# Altium schematic sheet Peripherals.SchDoc
size A4
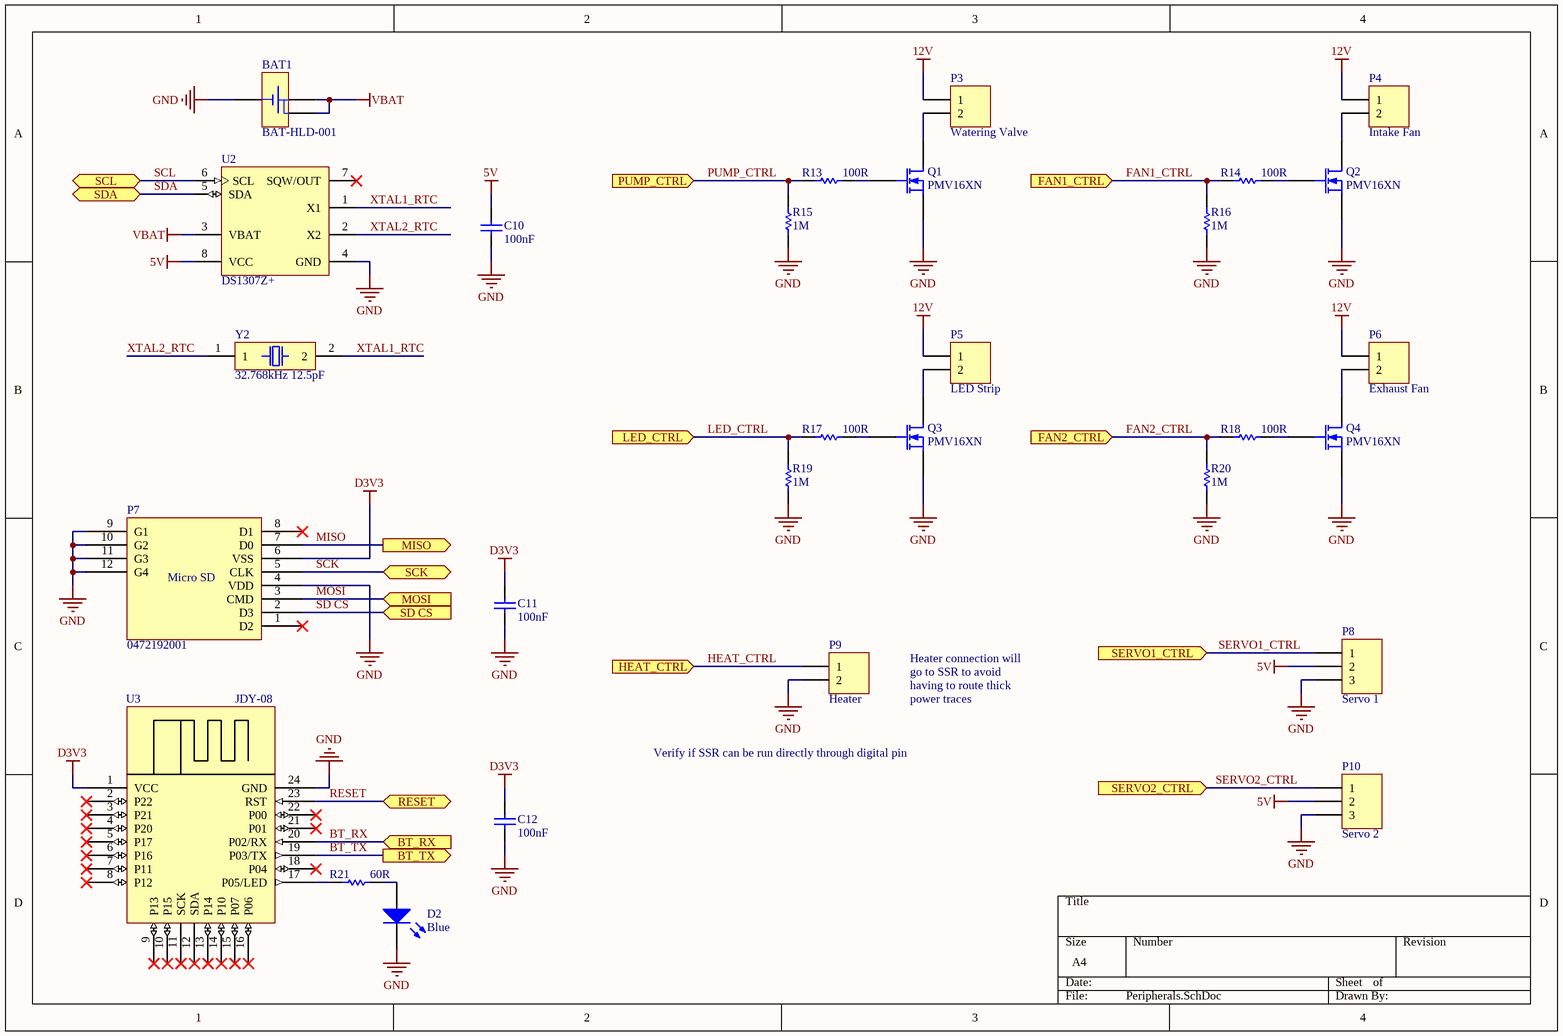
[diagram p0: Peripherals.SchDoc]

## Parts
BAT1  BAT-HLD-001  [BATHLD-001]
C10  100nF  [CAP0603]
C11  100nF  [CAP0603]
C12  100nF  [CAP0603]
D2  Blue  [DIODE0603]
P3  Watering Valve  [MOLEX MICROLATCH 2CT]
P4  Intake Fan  [MOLEX MICROLATCH 2CT]
P5  LED Strip  [MOLEX MICROLATCH 2CT]
P6  Exhaust Fan  [MOLEX MICROLATCH 2CT]
P7  0472192001  [MOLEX MICRO SD]
P8  Servo 1  [MOLEX MICROLATCH 3CT]
P9  Heater  [MOLEX MICROLATCH 2CT]
P10  Servo 2  [MOLEX MICROLATCH 3CT]
Q1  PMV16XN  [SOT-23]
Q2  PMV16XN  [SOT-23]
Q3  PMV16XN  [SOT-23]
Q4  PMV16XN  [SOT-23]
R13  100R  [RES0603]
R14  100R  [RES0603]
R15  1M  [RES0603]
R16  1M  [RES0603]
R17  100R  [RES0603]
R18  100R  [RES0603]
R19  1M  [RES0603]
R20  1M  [RES0603]
R21  60R  [RES0603]
U2  DS1307Z+  [SOIC8 150mil]
U3  JDY-08  [JDY-08]
Y2  32.768kHz 12.5pF  [3210 XTAL]

## Ports
BT_RX (in), BT_TX (out), FAN1_CTRL (in), FAN2_CTRL (in), HEAT_CTRL (in), LED_CTRL (in), MISO (out), MOSI (in), PUMP_CTRL (in), RESET (bidir), SCK (bidir), SCL (bidir), SD CS (in), SDA (bidir), SERVO1_CTRL (in), SERVO2_CTRL (in)

## Nets
5V: C10.2 P8.2 P10.2 U2.8(VCC)
12V: P3.1 P4.1 P5.1 P6.1
D3V3: C11.2 C12.2 P7.6(VSS) U3.1(VCC)
GND: BAT1.1(-) C10.1 C11.1 C12.1 D2.2(K) P7.4(VDD) P7.9(G1) P7.10(G2) P7.11(G3) P7.12(G4) P8.3 P9.2 P10.3 Q1.2(S) Q2.2(S) Q3.2(S) Q4.2(S) R15.2 R16.2 R19.2 R20.2 U2.4(GND) U3.24(GND)
VBAT: BAT1.2(+) BAT1.3(+) U2.3(VBAT)
BT_RX: U3.20(P02/RX) ; port BT_RX
BT_TX: U3.19(P03/TX) ; port BT_TX
FAN1_CTRL: R14.2 R16.1 ; port FAN1_CTRL
FAN2_CTRL: R18.2 R20.1 ; port FAN2_CTRL
HEAT_CTRL: P9.1 ; port HEAT_CTRL
LED_CTRL: R17.2 R19.1 ; port LED_CTRL
MISO: P7.7(D0) ; port MISO
MOSI: P7.3(CMD) ; port MOSI
PUMP_CTRL: R13.2 R15.1 ; port PUMP_CTRL
RESET: U3.23(RST) ; port RESET
SCK: P7.5(CLK) ; port SCK
SCL: U2.6(SCL) ; port SCL
SD CS: P7.2(D3) ; port SD CS
SDA: U2.5(SDA) ; port SDA
SERVO1_CTRL: P8.1 ; port SERVO1_CTRL
SERVO2_CTRL: P10.1 ; port SERVO2_CTRL
XTAL1_RTC: U2.1(X1) Y2.2
XTAL2_RTC: U2.2(X2) Y2.1
NetD2_1: D2.1(A) R21.1
NetP3_2: P3.2 Q1.3(D)
NetP4_2: P4.2 Q2.3(D)
NetP5_2: P5.2 Q3.3(D)
NetP6_2: P6.2 Q4.3(D)
NetQ1_1: Q1.1(G) R13.1
NetQ2_1: Q2.1(G) R14.1
NetQ3_1: Q3.1(G) R17.1
NetQ4_1: Q4.1(G) R18.1
NetR21_2: R21.2 U3.17(P05/LED)

Not connected (* = marked no-connect by the designer): P7 1(D2)* 8(D1)*; U2 7(SQW/OUT)*; U3 2(P22)* 3(P21)* 4(P20)* 5(P17)* 6(P16)* 7(P11)* 8(P12)* 9(P13)* 10(P15)* 11(SCK)* 12(SDA)* 13(P14)* 14(P10)* 15(P07)* 16(P06)* 18(P04)* 21(P01)* 22(P00)*

## Notes on the sheet
- Heater connection will
- go to SSR to avoid
- having to route thick
- power traces
- Verify if SSR can be run directly through digital pin
- (in symbol Micro SD Card) Micro SD

## Library data of the parts
BAT1 = CMP-0168-00043-1: 20mm Coin Cell Battery Holder; PCB_Layout: Complies with manufacturer's recommendation.; DatasheetVersion: rev1.0, Dec-2007; PackageVersion: rev1.0, Dec-2007; PackageReference: BATHLD-001; PackageDescription: Low Profile SM Battery Holder, 20mm Lithium Cell, 21.1 x 15.3 x 4.2 mm Body
C10-C12 = Capacitor: Published: 8-Jun-2000; LatestRevisionDate: 17-Jul-2002; LatestRevisionNote: Re-released for DXP Platform.; PackageReference: RAD-0.3; Publisher: Altium Limited; PackageDescription: Radial Cap, Thru-Hole; 2 Leads; 0.3 in Pin Spacing; Value: Value
D2 = LED: Light Emitting Diode; Published: 8-Jun-2000; LatestRevisionDate: 17-Jul-2002; LatestRevisionNote: Re-released for DXP Platform.; PackageVersion: Sep-1996; PackageReference: SMC; Publisher: Altium Limited; PackageDescription: DO-214-AB/SMC; 2 C-Bend Leads; Body 7.9 x 5.9 mm, inc. leads (LxW); Code_JEDEC: DO-214-AB
P3-P6 P9 = 2X1 2.54MM: Header, 2-Pin; LatestRevisionDate: 17-Jul-2002; LatestRevisionNote: Re-released for DXP Platform.; Publisher: Altium Limited
P7 = Micro SD Card
P8 P10 = 3X1 2.54MM: Header, 3-Pin; LatestRevisionDate: 17-Jul-2002; LatestRevisionNote: Re-released for DXP Platform.; Publisher: Altium Limited
Q1-Q4 = MOSFET-N: N-Channel MOSFET; Published: 8-Jun-2000; LatestRevisionDate: 17-Jul-2002; LatestRevisionNote: Re-released for DXP Platform.; PackageVersion: 1995/1996; PackageReference: E3; Publisher: Altium Limited; PackageDescription: TO, Flat Index; 3 In-Line, Axial Leads; Body Dia. 4.6mm; Lead Dia. 0.5 mm (max)
R13-R21 = Resistor: Published: 8-Jun-2000; LatestRevisionDate: 17-Jul-2002; LatestRevisionNote: Re-released for DXP Platform.; PackageReference: AXIAL-0.3; Publisher: Altium Limited; PackageDescription: Axial Device, Thru-Hole; 2 Leads; 0.3 in Pin Spacing; Value: Value
U2 = DS1307Z+: 64 x 8, Serial, I2C Real-Time Clock, 5.0V, 8-Pin SO, 0 to 70 degC, Pb-Free; ComponentLink3Description: Package Specification; DatasheetVersion: 10-Feb-2008; Code_IPC: SOIC127P600-8; ComponentLink2Description: Datasheet; Code_JEDEC: MS-012-AA; ComponentLink2URL: http://datasheets.maxim-ic.com/en/ds/DS1307.pdf; ComponentLink3URL: http://pdfserv.maxim-ic.com/package_dwgs/21-0041.PDF; ComponentLink1URL: http://www.maxim-ic.com; PackageReference: S8+2; ComponentLink1Description: Manufacturer URL; PackageDescription: 8-Pin Small-Outline IC, Narrow (0.15in), 1.27 mm Pitch, SOIC (N), Pb-Free; PackageVersion: revC, 2010
U3 = JDY-08: HM-11 JDY-08 Bluetooth module
Y2 = XTAL 3210